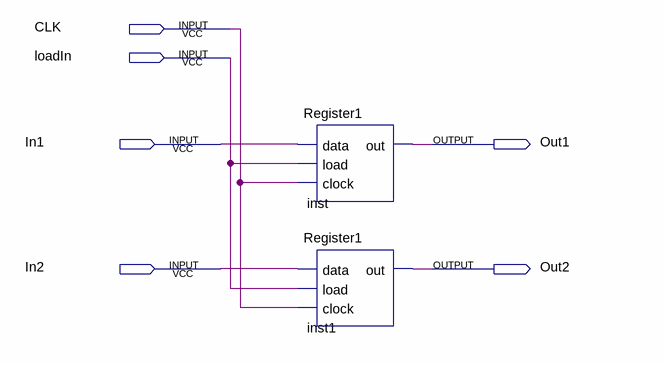
[diagram p0: schematic sheet]
// Quartus schematic Register2.bdf as structural Verilog: 2 symbols, 6 pins
module Register2 (
  input  CLK,
  input  loadIn,
  input  In1,
  input  In2,
  output Out1,
  output Out2
);

  Register1 inst (.data(In1), .load(loadIn), .clock(CLK), .out(Out1));
  Register1 inst1 (.data(In2), .load(loadIn), .clock(CLK), .out(Out2));
endmodule
